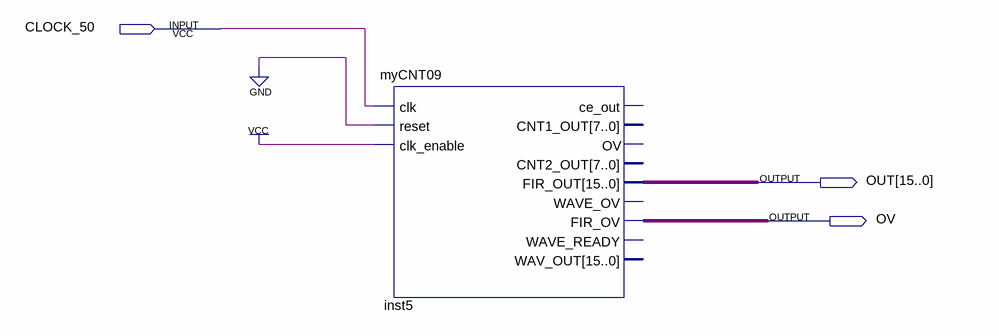
[diagram p0: schematic sheet]
// Quartus schematic test1_quartus.bdf as structural Verilog: 1 symbols, 3 pins
module test1_quartus (
  input  CLOCK_50,
  output [15:0] OUT,
  output OV
);

  myCNT09 inst5 (
    .clk(CLOCK_50), .reset(1'b0), .clk_enable(1'b1), .FIR_OUT(OUT), .FIR_OV(OV));  // open: ce_out, CNT1_OUT, OV, CNT2_OUT, WAVE_OV, WAVE_READY, WAV_OUT
endmodule
